# Altium schematic sheet Interface.SchDoc
size A4
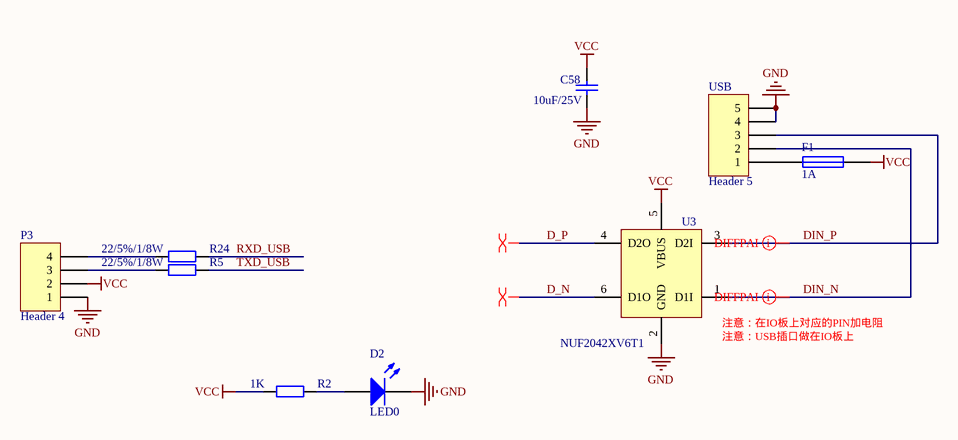
[diagram p0: Interface.SchDoc]

## Parts
C58  10uF/25V  [0603C]
D2  LED0  [0603LED]
F1  1A  [0805R]
P3  Header 4  [HDR1X4]
R2  1K  [0402R]
R5  22/5%/1/8W  [0402R]
R24  22/5%/1/8W  [0402R]
U3  NUF2042XV6T1  [SOT563-6]
USB  Header 5  [Micro_USB_PH]

## Nets
GND: C58.1 D2.2(K) P3.1 U3.2(GND) USB.4 USB.5
VCC: C58.2 F1.2 P3.2 R2.1 U3.5(VBUS)
D_N: U3.6(D1O)
D_P: U3.4(D2O)
DIN_N: U3.1(D1I) USB.2
DIN_P: U3.3(D2I) USB.3
RXD_USB: R24.2
TXD_USB: R5.2
NetD2_1: D2.1(A) R2.2
NetF1_1: F1.1 USB.1
NetP3_3: P3.3 R5.1
NetP3_4: P3.4 R24.1

## Layout directives
differential pair: D_N, D_P, DIN_N, DIN_P

## Notes on the sheet
- (near U3) 注意：在IO板上对应的PIN加电阻
- (near U3) 注意：USB插口做在IO板上

## Library data of the parts
C58 = Cap: Capacitor; Value: 106/50V; Published: 8-Jun-2000; LatestRevisionDate: 17-Jul-2002; LatestRevisionNote: Re-released for DXP Platform.; PackageReference: RAD-0.3; Publisher: Altium Limited
D2 = LED0: Typical INFRARED GaAs LED; Published: 8-Jun-2000; LatestRevisionDate: 08-Jul-2005; LatestRevisionNote: Mech Layer 1 removed.; PackageReference: LED-0; Publisher: Altium Limited
F1 = Fuse 1: Fuse; Published: 8-Jun-2000; LatestRevisionDate: 17-Jul-2002; LatestRevisionNote: Re-released for DXP Platform.; PackageReference: PIN-W2/E2.8; Publisher: Altium Limited
P3 = Header 4: Header, 4-Pin; LatestRevisionDate: 17-Jul-2002; LatestRevisionNote: Re-released for DXP Platform.; Publisher: Altium Limited
R2 R5 R24 = Resistor: Resistor SMD - IEC symbol version; Value: NC; LatestRevisionDate: 27-Jul-20  -  Semtech
USB = Header 5: Header, 5-Pin; LatestRevisionDate: 17-Jul-2002; LatestRevisionNote: Re-released for DXP Platform.; Publisher: Altium Limited